# Altium schematic sheet Sheet3.SchDoc
size A; SheetNumber: 3; SheetTotal: 3
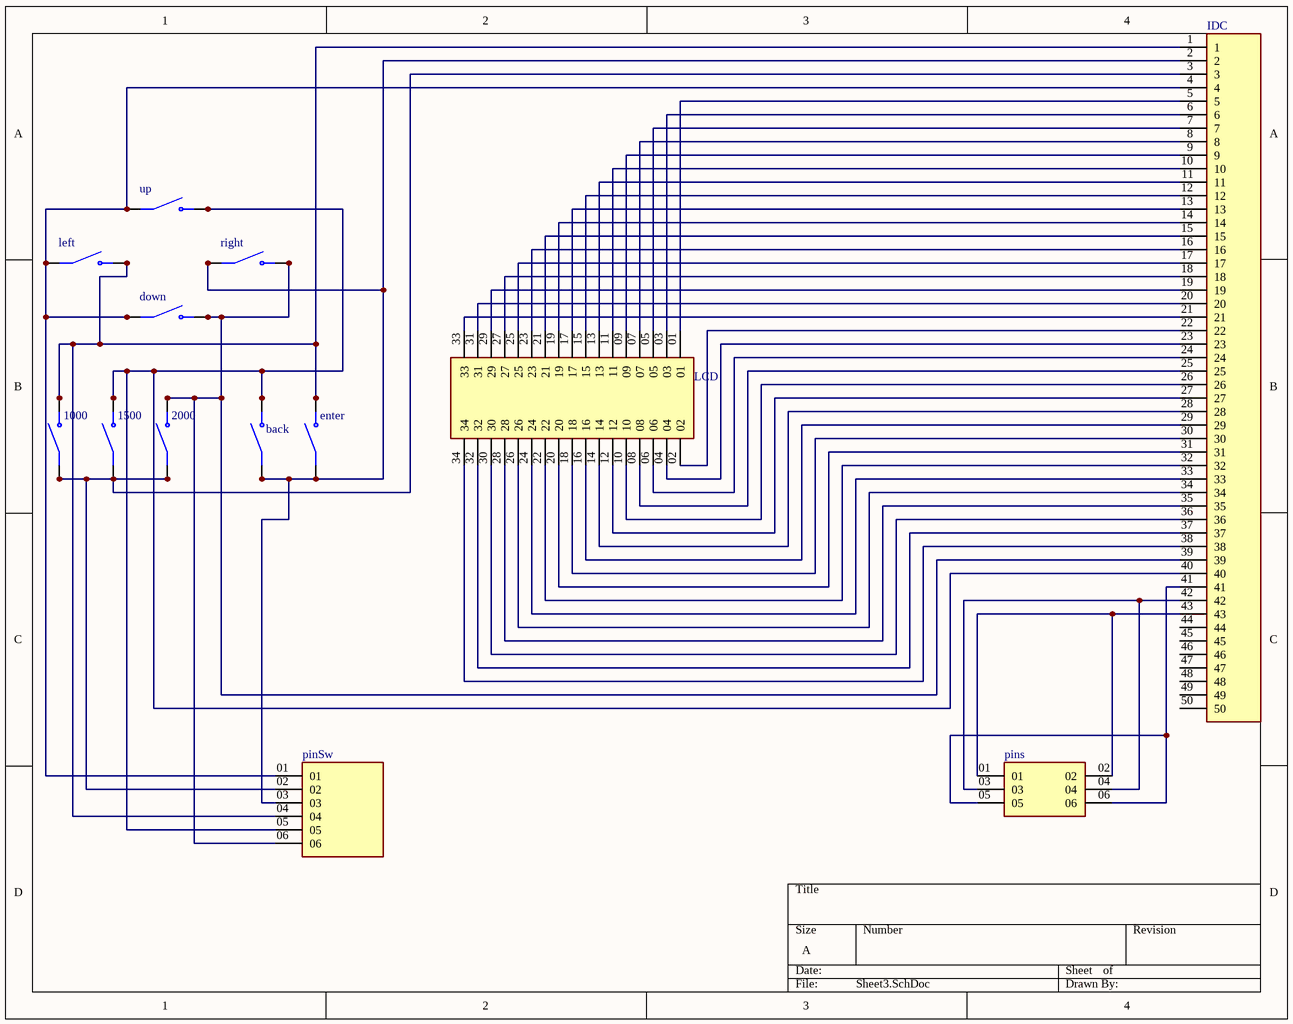
[diagram p0: Sheet3.SchDoc]

## Parts
1000  4-1437565-9  [SW_4-1437565-9]  (value not drawn)
1500  4-1437565-9  [SW_4-1437565-9]  (value not drawn)
2000  4-1437565-9  [SW_4-1437565-9]  (value not drawn)
back  4-1437565-9  [SW_4-1437565-9]  (value not drawn)
down  4-1437565-9  [SW_4-1437565-9]  (value not drawn)
enter  4-1437565-9  [SW_4-1437565-9]  (value not drawn)
IDC  1-1761686-5  [TE_1-1761686-5]  (value not drawn)
LCD  TSW-117-23-G-D  [SAMTEC_TSW-117-23-G-D]  (value not drawn)
left  4-1437565-9  [SW_4-1437565-9]  (value not drawn)
pins  MTLW-103-07-L-D-320  [SAMTEC_MTLW-103-07-L-D-320]  (value not drawn)
pinSw  MTLW-106-05-T-S-137  [SAMTEC_MTLW-106-05-T-S-137]  (value not drawn)
right  4-1437565-9  [SW_4-1437565-9]  (value not drawn)
up  4-1437565-9  [SW_4-1437565-9]  (value not drawn)

## Nets
Net1000_1: 1000.1(COM) 1000.2(COM) 1500.1(COM) 1500.2(COM) 2000.1(COM) 2000.2(COM) IDC.3 pinSw.02
Net1000_3: 1000.3(NO) 1000.4(NO) enter.3(NO) enter.4(NO) IDC.1 left.3(NO) left.4(NO) pinSw.04
Net1500_3: 1500.3(NO) 1500.4(NO) back.3(NO) back.4(NO) IDC.40 pinSw.05 up.3(NO) up.4(NO)
Net2000_3: 2000.3(NO) 2000.4(NO) down.3(NO) down.4(NO) IDC.39 pinSw.06 right.3(NO) right.4(NO)
Netback_1: back.1(COM) back.2(COM) enter.1(COM) enter.2(COM) IDC.2 pinSw.03 right.1(COM) right.2(COM)
Netdown_1: down.1(COM) down.2(COM) IDC.4 left.1(COM) left.2(COM) pinSw.01 up.1(COM) up.2(COM)
NetIDC_5: IDC.5 LCD.01
NetIDC_6: IDC.6 LCD.03
NetIDC_7: IDC.7 LCD.05
NetIDC_8: IDC.8 LCD.07
NetIDC_9: IDC.9 LCD.09
NetIDC_10: IDC.10 LCD.11
NetIDC_11: IDC.11 LCD.13
NetIDC_12: IDC.12 LCD.15
NetIDC_13: IDC.13 LCD.17
NetIDC_14: IDC.14 LCD.19
NetIDC_15: IDC.15 LCD.21
NetIDC_16: IDC.16 LCD.23
NetIDC_17: IDC.17 LCD.25
NetIDC_18: IDC.18 LCD.27
NetIDC_19: IDC.19 LCD.29
NetIDC_20: IDC.20 LCD.31
NetIDC_21: IDC.21 LCD.33
NetIDC_22: IDC.22 LCD.02
NetIDC_23: IDC.23 LCD.04
NetIDC_24: IDC.24 LCD.06
NetIDC_25: IDC.25 LCD.08
NetIDC_26: IDC.26 LCD.10
NetIDC_27: IDC.27 LCD.12
NetIDC_28: IDC.28 LCD.14
NetIDC_29: IDC.29 LCD.16
NetIDC_30: IDC.30 LCD.18
NetIDC_31: IDC.31 LCD.20
NetIDC_32: IDC.32 LCD.22
NetIDC_33: IDC.33 LCD.24
NetIDC_34: IDC.34 LCD.26
NetIDC_35: IDC.35 LCD.28
NetIDC_36: IDC.36 LCD.30
NetIDC_37: IDC.37 LCD.32
NetIDC_38: IDC.38 LCD.34
NetIDC_41: IDC.41 pins.05 pins.06
NetIDC_42: IDC.42 pins.03 pins.04
NetIDC_43: IDC.43 pins.01 pins.02

Not connected (* = marked no-connect by the designer): IDC 44 45 46 47 48 49 50

## Library data of the parts
1000 1500 2000 back down enter left right up = 4-1437565-9: Switch, Tactile, SPST-NO, .05A, 24V, Surface Mount, Off-Mom, FSMJSMA Series | TE Connectivity 4-1437565-9; Contact_Current_Rating: 50 mA; Configuration_Pole-Throw: Single Pole - Single Throw; SnapEDA_Link: https://www.snapeda.com/parts/4-1437565-9/TE+Connectivity+ALCOSWITCH+Switches/view-part/?ref=snap; Package: None; Value: *; MF: TE Connectivity; MP: 4-1437565-9; EU_RoHS_Compliance: Compliant; Check_prices: https://www.snapeda.com/parts/4-1437565-9/TE+Connectivity+ALCOSWITCH+Switches/view-part/?ref=eda
IDC = 1-1761686-5: Package: None; Price: None; Value: *; MP: 1-1761686-5; Availability: Unavailable
LCD = TSW-117-23-G-D: Package: None; Price: None; Value: *; MP: TSW-117-23-G-D; Availability: Unavailable
pins = MTLW-103-07-L-D-320: MP: MTLW-103-07-L-D-320; Package: None; Price: None; Availability: Unavailable; Value: *
pinSw = MTLW-106-05-T-S-137: Value: *; Price: None; Package: None; Availability: Unavailable; MP: MTLW-106-05-T-S-137